# EAGLE schematic telakone (EAGLE 7.6.0)

## Sheet 1 of 8: POWER
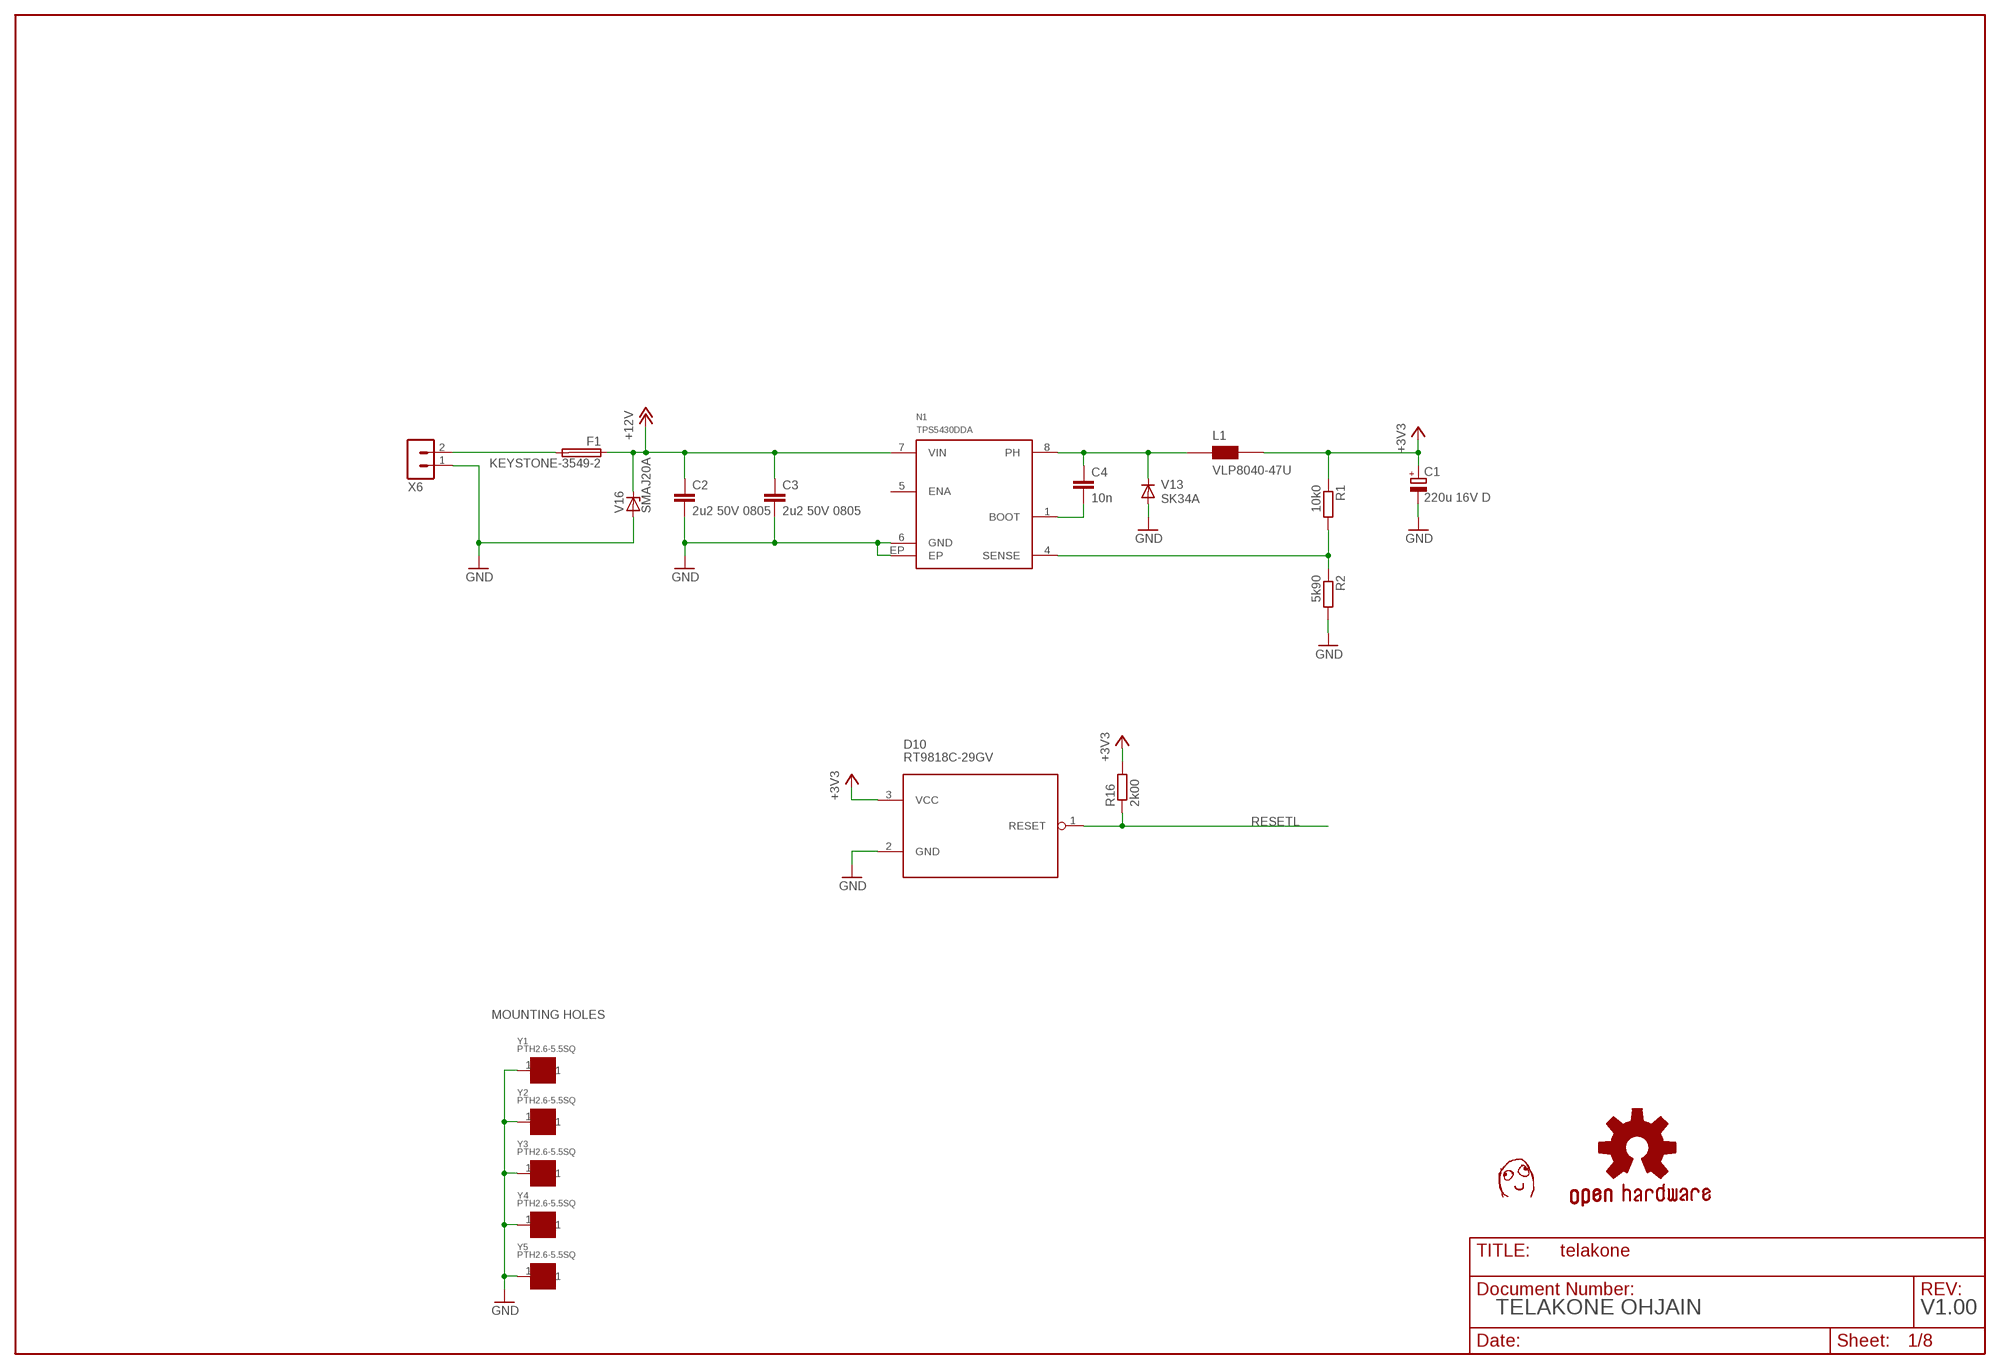
[diagram p0: schematic, sheet 1]

### Parts
C1  220u 16V D  CPOL-EUCT7343  [CT7343]
C2  2u2 50V 0805  CAP0805  [C0805]
C3  2u2 50V 0805  CAP0805  [C0805]
C4  10n  CAP0603  [C0603]
D10  RT9818C-29GV  [SOT23]
F1  KEYSTONE-3549-2  [KEYSTONE-3549-2]
L1  VLP8040-47U  [VLP8040]
N1  TPS5430DDA  [SOIC8-N-EP]
R1  10k0  RES0603  [R0603]
R2  5k90  RES0603  [R0603]
R16  2k00  RES0603  [R0603]
U$1  DAFUG  [DAFUG]
V13  SK34A  [DO214AC]
V16  SMAJ20A  SMAJXXA  [DO214AC]
X6  TE_RUUVILIITIN2  [TE_RUUVILIITIN2]
Y1  PTH2.6-5.5SQ  [PTH-2.6-5.5SQ]
Y2  PTH2.6-5.5SQ  [PTH-2.6-5.5SQ]
Y3  PTH2.6-5.5SQ  [PTH-2.6-5.5SQ]
Y4  PTH2.6-5.5SQ  [PTH-2.6-5.5SQ]
Y5  PTH2.6-5.5SQ  [PTH-2.6-5.5SQ]

### Nets
+3V3: C1.+ D10.3(VCC) L1.2(B) R1.1 R16.2 ; also sheet 2,3,4,5,6,7,8
+12V: C2.1 C3.1 F1.1 F1.4 N1.7(VIN) V16.C ; also sheet 2,3,6
GND [other]: C1.- C2.2 C3.2 D10.2(GND) N1.6(GND) N1.EP R2.2 V13.A V16.A X6.1 Y1.1 Y2.1 Y3.1 Y4.1 Y5.1 ; also sheet 2,3,4,5,6,7,8
N$1: C4.1 L1.1(A) N1.8(PH) V13.C
N$2: C4.2 N1.1(BOOT)
N$4: N1.4(SENSE) R1.2 R2.1
N$8: F1.2 F1.3 X6.2
RESETL: D10.1(RESET) R16.1 ; also sheet 6,8
Unconnected: N1.5(ENA)

### Notes on the sheet
- MOUNTING HOLES
- TELAKONE OHJAIN | V1.00

## Sheet 2 of 8: OUTPUTS
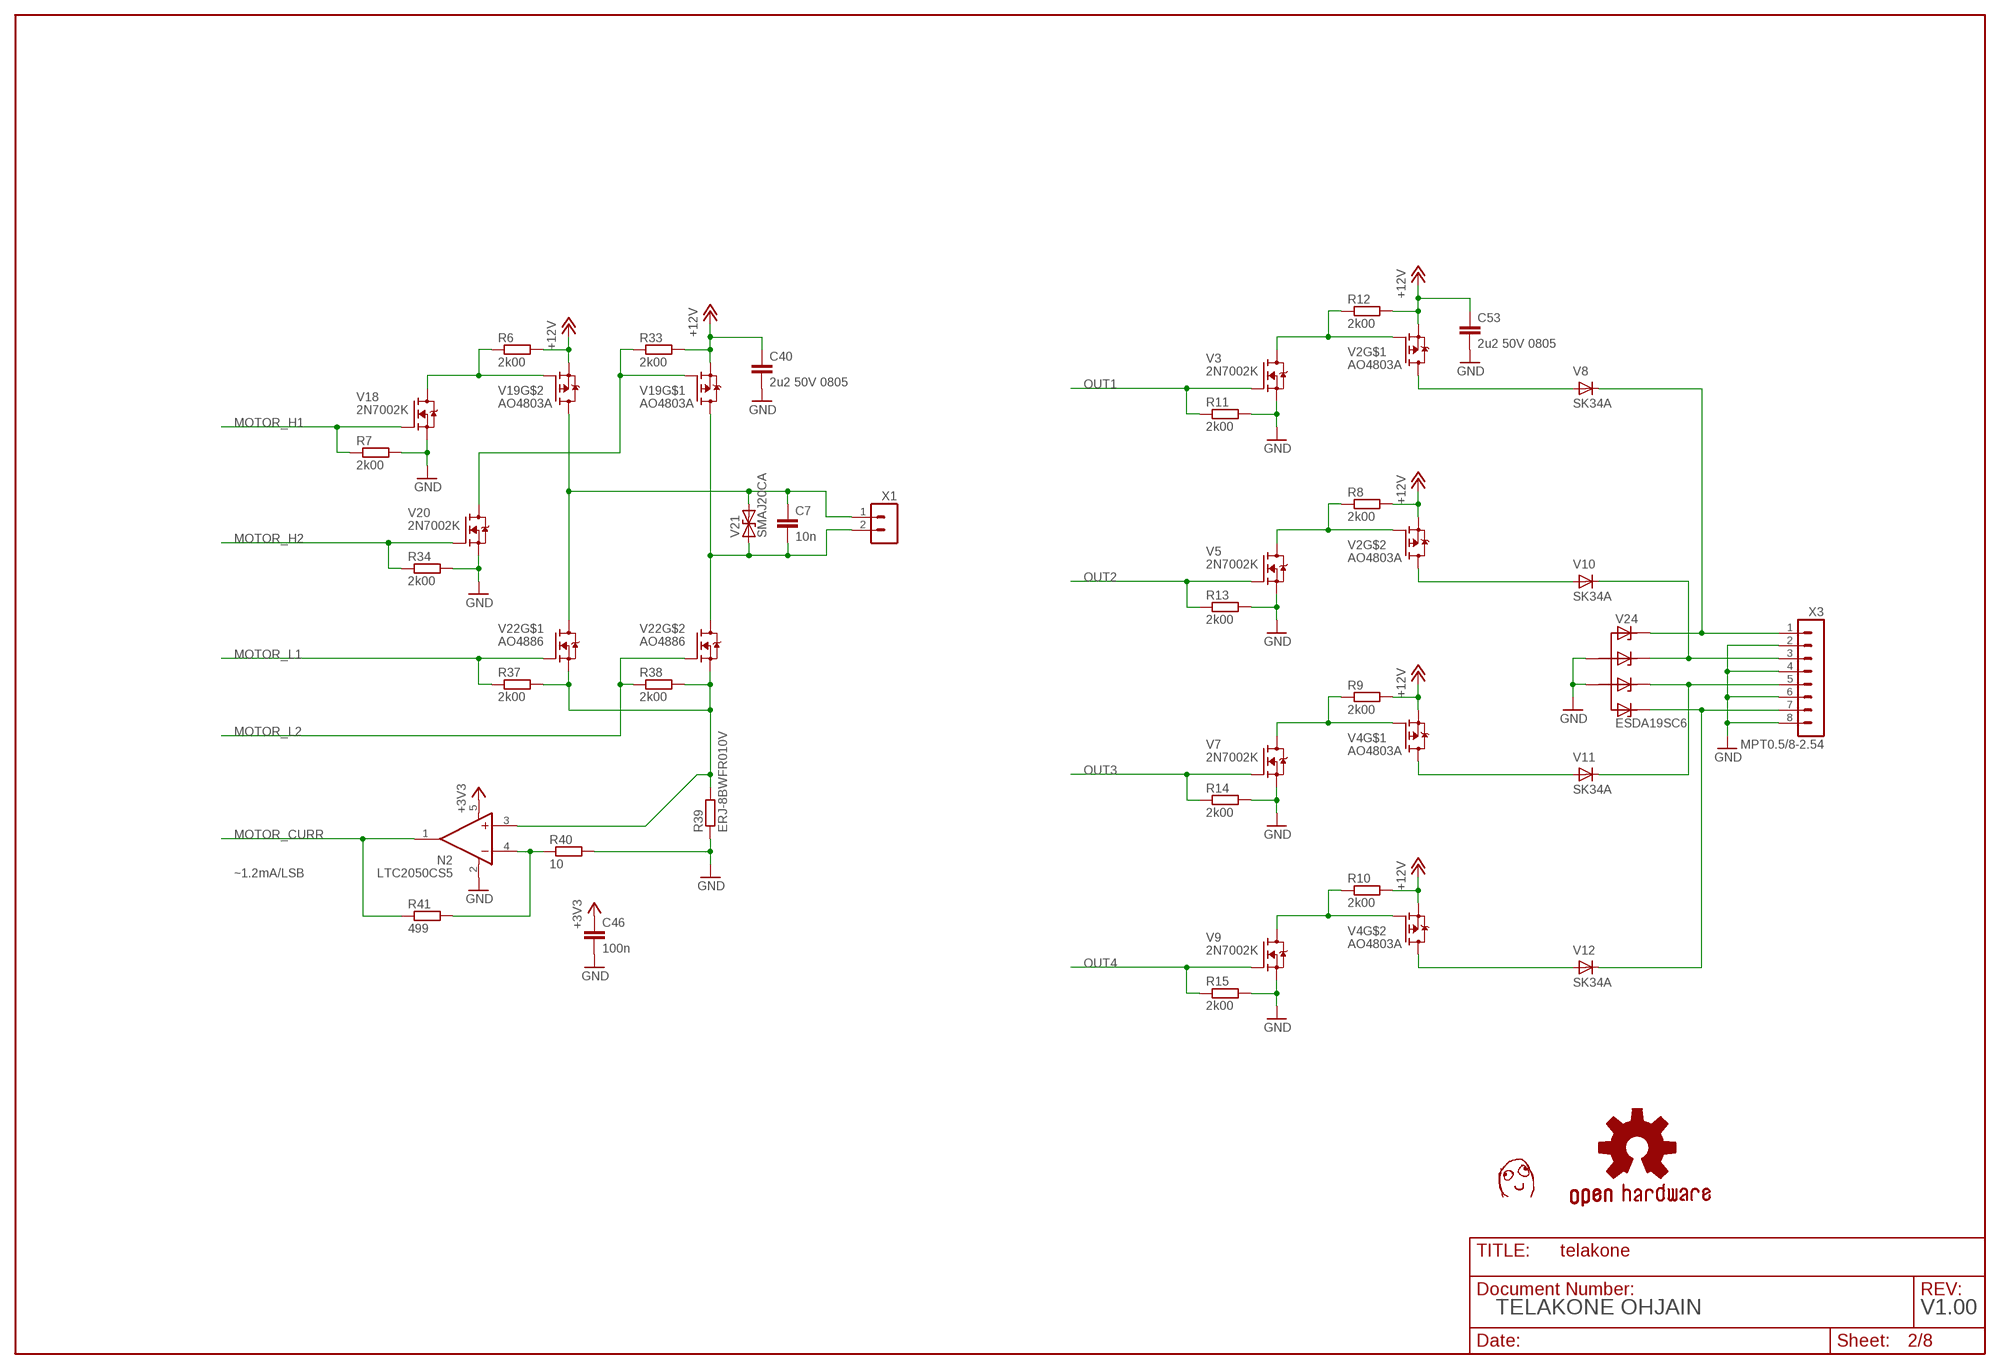
[diagram p1: schematic, sheet 2]

### Parts
C7  10n  CAP0603  [C0603]
C40  2u2 50V 0805  CAP0805  [C0805]
C46  100n  CAP0603  [C0603]
C53  2u2 50V 0805  CAP0805  [C0805]
N2  LTC2050CS5  [SOT95P280X145-5N]
R6  2k00  RES0603  [R0603]
R7  2k00  RES0603  [R0603]
R8  2k00  RES0603  [R0603]
R9  2k00  RES0603  [R0603]
R10  2k00  RES0603  [R0603]
R11  2k00  RES0603  [R0603]
R12  2k00  RES0603  [R0603]
R13  2k00  RES0603  [R0603]
R14  2k00  RES0603  [R0603]
R15  2k00  RES0603  [R0603]
R33  2k00  RES0603  [R0603]
R34  2k00  RES0603  [R0603]
R37  2k00  RES0603  [R0603]
R38  2k00  RES0603  [R0603]
R39  ERJ-8BWFR010V  RES1206  [R1206]
R40  10  RES0603  [R0603]
R41  499  RES0603  [R0603]
U$3  DAFUG  [DAFUG]
V2  AO4803A  [SOIC8-N_MC]
V3  2N7002K  [SOT23]
V4  AO4803A  [SOIC8-N_MC]
V5  2N7002K  [SOT23]
V7  2N7002K  [SOT23]
V8  SK34A  [DO214AC]
V9  2N7002K  [SOT23]
V10  SK34A  [DO214AC]
V11  SK34A  [DO214AC]
V12  SK34A  [DO214AC]
V18  2N7002K  [SOT23]
V19  AO4803A  [SOIC8-N_MC]
V20  2N7002K  [SOT23]
V21  SMAJ20CA  SMAJXXCA  [DO214AC]
V22  AO4886  [SOIC8-N_MC]
V24  ESDA19SC6  ESDAXXSC6  [SOT23-6]
X1  TE_RUUVILIITIN2  [TE_RUUVILIITIN2]
X3  MPT0.5/8-2.54  [MPT0.5/8-2.54]

### Nets
+3V3: C46.1 N2.5(V+) ; also sheet 1,3,4,5,6,7,8
+12V: C40.1 C53.1 R6.2 R8.2 R9.2 R10.2 R12.2 R33.2 V2.1(S) V2.3(S) V4.1(S) V4.3(S) V19.1(S) V19.3(S) ; also sheet 1,3,6
GND [other]: C40.2 C46.2 C53.2 N2.2(V-) R7.2 R11.2 R13.2 R14.2 R15.2 R34.2 R39.1 R40.2 V3.2(S) V5.2(S) V7.2(S) V9.2(S) V18.2(S) V20.2(S) V24.2(A) V24.5(A1) X3.2 X3.4 X3.6 X3.8 ; also sheet 1,3,4,5,6,7,8
MOTOR_CURR: N2.1(OUT) R41.1 ; also sheet 7
MOTOR_H1: R7.1 V18.1(G) ; also sheet 7
MOTOR_H2: R34.1 V20.1(G) ; also sheet 7
MOTOR_L1: R37.1 V22.4(G) ; also sheet 7
MOTOR_L2: R38.1 V22.2(G) ; also sheet 7
N$3: R6.1 V18.3(D) V19.2(G)
N$6: R33.1 V19.4(G) V20.3(D)
N$7: N2.3(+IN) R37.2 R38.2 R39.2 V22.1(S) V22.3(S)
N$9: N2.4(-IN) R40.1 R41.2
N$10: R8.1 V2.2(G) V5.3(D)
N$11: R12.1 V2.4(G) V3.3(D)
N$13: R9.1 V4.4(G) V7.3(D)
N$15: R10.1 V4.2(G) V9.3(D)
N$17: V12.C V24.6(C3) X3.7
N$19: V11.C V24.4(C2) X3.5
N$20: V10.C V24.3(C1) X3.3
N$21: V8.C V24.1(C) X3.1
NERT: V2.5(D) V2.6(D) V8.A
NERT1: V2.7(D) V2.8(D) V10.A
NERT2: V4.5(D) V4.6(D) V11.A
NERT3: V4.7(D) V4.8(D) V12.A
NERT4: C7.1 V19.7(D) V19.8(D) V21.A V22.5(D) V22.6(D) X1.1
NERT5: C7.2 V19.5(D) V19.6(D) V21.C V22.7(D) V22.8(D) X1.2
OUT1: R11.1 V3.1(G) ; also sheet 7
OUT2: R13.1 V5.1(G) ; also sheet 7
OUT3: R14.1 V7.1(G) ; also sheet 7
OUT4: R15.1 V9.1(G) ; also sheet 7

### Notes on the sheet
- ~1.2mA/LSB
- TELAKONE OHJAIN | V1.00

## Sheet 3 of 8: INPUTS
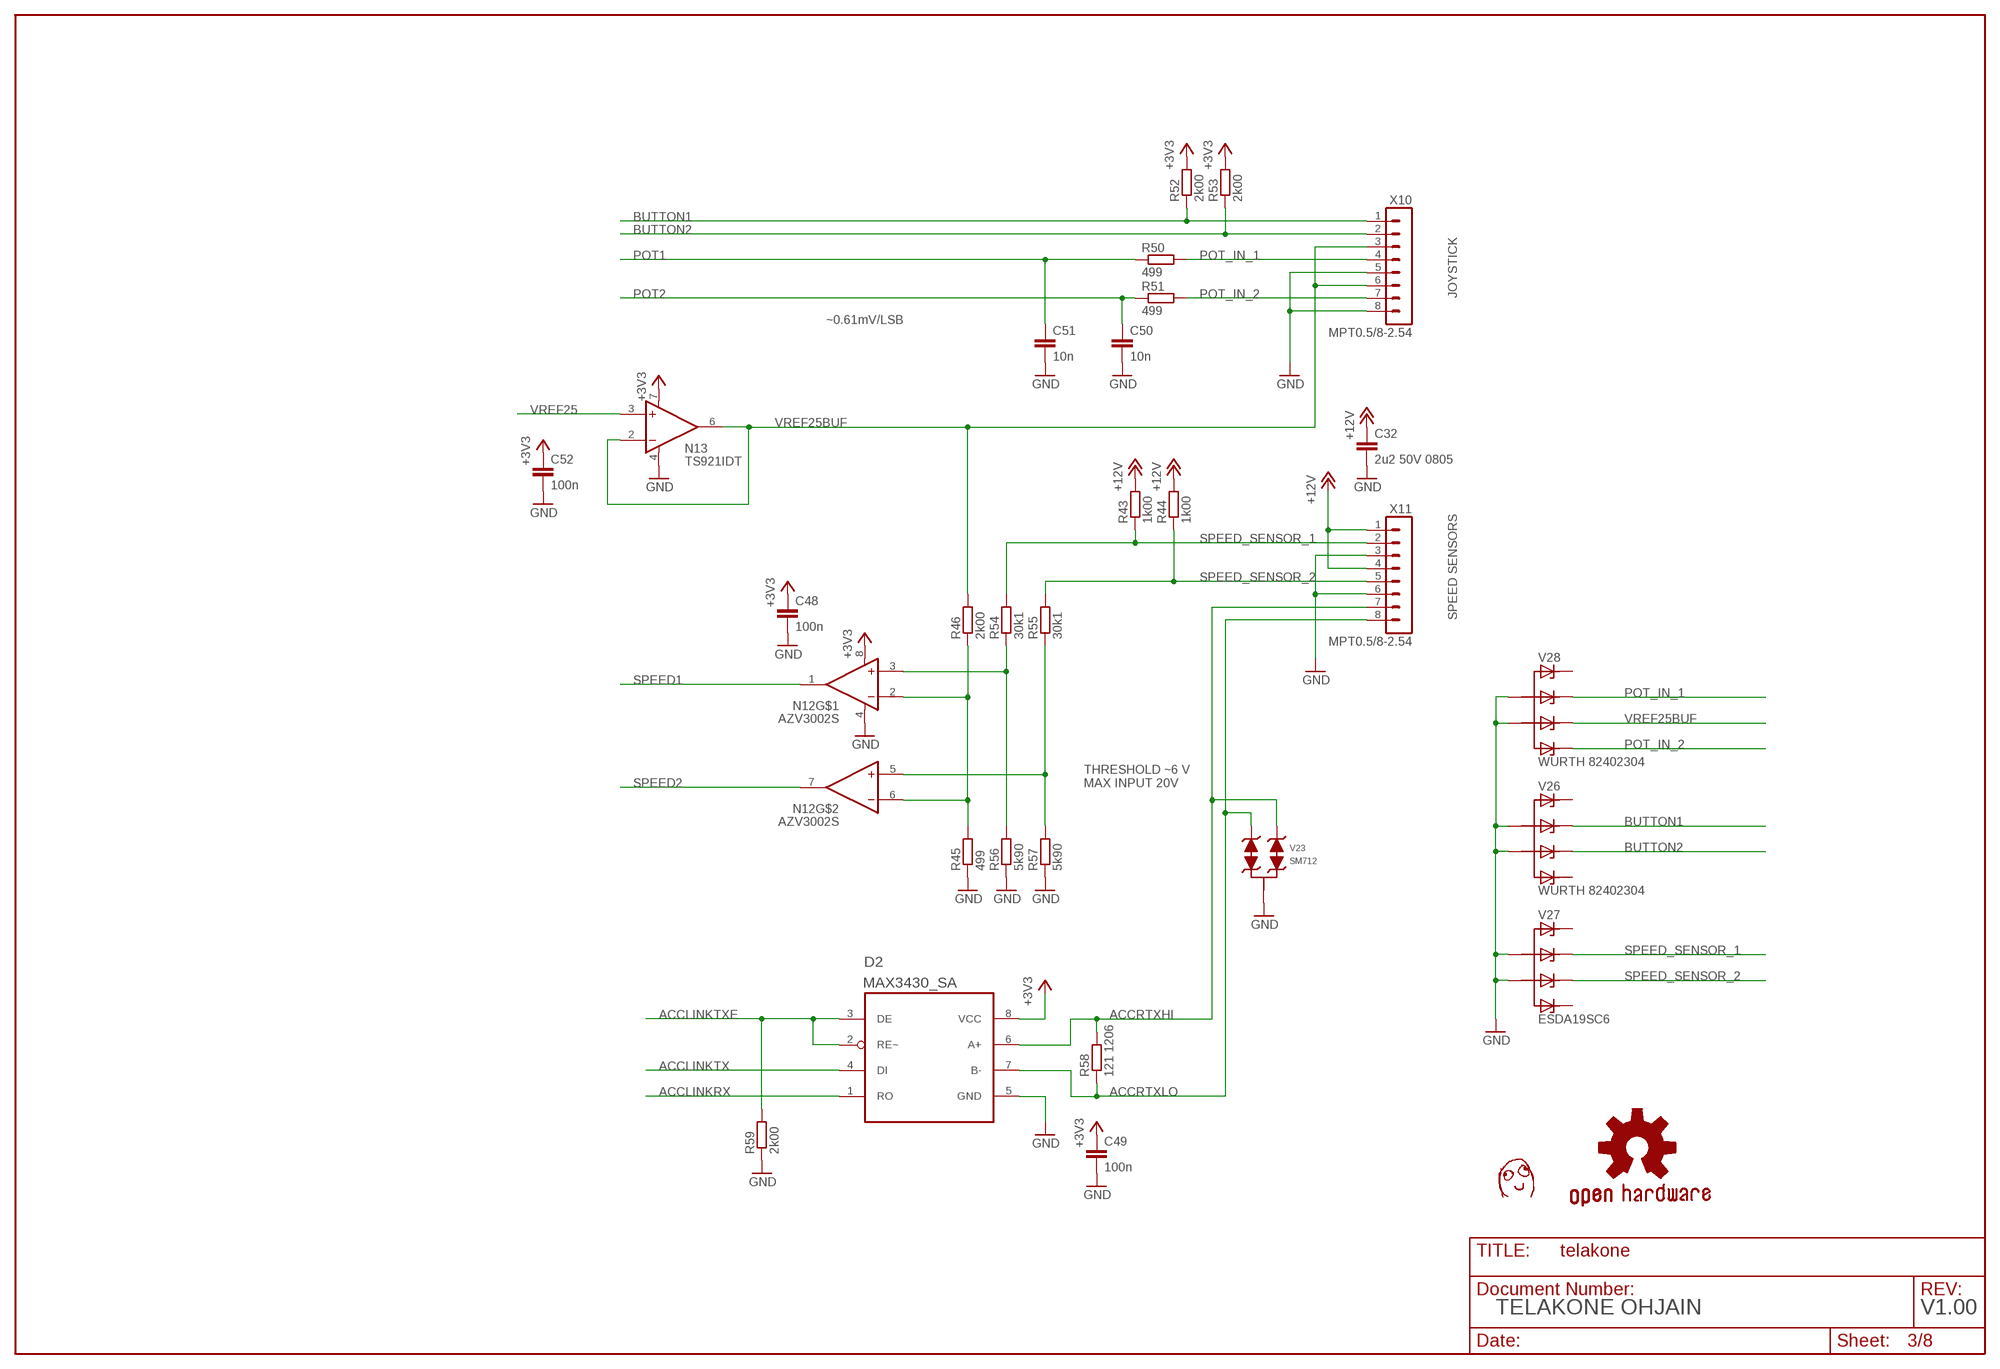
[diagram p2: schematic, sheet 3]

### Parts
C32  2u2 50V 0805  CAP0805  [C0805]
C48  100n  CAP0603  [C0603]
C49  100n  CAP0603  [C0603]
C50  10n  CAP0603  [C0603]
C51  10n  CAP0603  [C0603]
C52  100n  CAP0603  [C0603]
D2  MAX3430_SA  MAX3088_SA  [SOIC8-N_MC]
N12  AZV3002S  [SOIC8-N_MC]
N13  TS921IDT  [SOIC8-N_MC]
R43  1k00  RES0603  [R0603]
R44  1k00  RES0603  [R0603]
R45  499  RES0603  [R0603]
R46  2k00  RES0603  [R0603]
R50  499  RES0603  [R0603]
R51  499  RES0603  [R0603]
R52  2k00  RES0603  [R0603]
R53  2k00  RES0603  [R0603]
R54  30k1  RES0603  [R0603]
R55  30k1  RES0603  [R0603]
R56  5k90  RES0603  [R0603]
R57  5k90  RES0603  [R0603]
R58  121 1206  RES1206  [R1206]
R59  2k00  RES0603  [R0603]
U$5  DAFUG  [DAFUG]
V23  SM712  [SOT23]
V26  WURTH 82402304  ESDAXXSC6  [SOT23-6]
V27  ESDA19SC6  ESDAXXSC6  [SOT23-6]
V28  WURTH 82402304  ESDAXXSC6  [SOT23-6]
X10  MPT0.5/8-2.54  [MPT0.5/8-2.54]
X11  MPT0.5/8-2.54  [MPT0.5/8-2.54]

### Nets
+3V3: C48.1 C49.1 C52.1 D2.8(VCC) N12.8(V+) N13.7(V+) R52.2 R53.2 ; also sheet 1,2,4,5,6,7,8
+12V: C32.1 R43.2 R44.2 X11.1 X11.4 ; also sheet 1,2,6
ACCLINKRX: D2.1(RO) ; also sheet 7
ACCLINKTX: D2.4(DI) ; also sheet 7
ACCLINKTXE: D2.2(RE~) D2.3(DE) R59.2 ; also sheet 7
ACCRTXHI: D2.6(A+) R58.2 V23.1 X11.7
ACCRTXLO: D2.7(B-) R58.1 V23.2 X11.8
BUTTON1: R52.1 V26.3(C1) X10.1 ; also sheet 7
BUTTON2: R53.1 V26.4(C2) X10.2 ; also sheet 7
GND [other]: C32.2 C48.2 C49.2 C50.2 C51.2 C52.2 D2.5(GND) N12.4(V-) N13.4(V-) R45.1 R56.1 R57.1 R59.1 V23.3 V26.2(A) V26.5(A1) V27.2(A) V27.5(A1) V28.2(A) V28.5(A1) X10.5 X10.8 X11.3 X11.6 ; also sheet 1,2,4,5,6,7,8
N$5: N12.3(+IN) R54.1 R56.2
N$12: N12.5(+IN) R55.1 R57.2
N$14: N12.2(-IN) N12.6(-IN) R45.2 R46.1
POT1: C51.1 R50.1 ; also sheet 7
POT2: C50.1 R51.1 ; also sheet 7
POT_IN_1: R50.2 V28.3(C1) X10.4
POT_IN_2: R51.2 V28.6(C3) X10.7
SPEED1: N12.1(OUT) ; also sheet 7
SPEED2: N12.7(OUT) ; also sheet 7
SPEED_SENSOR_1: R43.1 R54.2 V27.3(C1) X11.2
SPEED_SENSOR_2: R44.1 R55.2 V27.4(C2) X11.5
VREF25: N13.3(+IN) ; also sheet 6
VREF25BUF: N13.2(-IN) N13.6(OUT) R46.2 V28.4(C2) X10.3 X10.6
Unconnected: V26.1(C) V26.6(C3) V27.1(C) V27.6(C3) V28.1(C)

### Notes on the sheet
- JOYSTICK
- ~0.61mV/LSB
- SPEED SENSORS
- THRESHOLD ~6 V
  MAX INPUT 20V
- TELAKONE OHJAIN | V1.00

## Sheet 4 of 8: DRIVE1
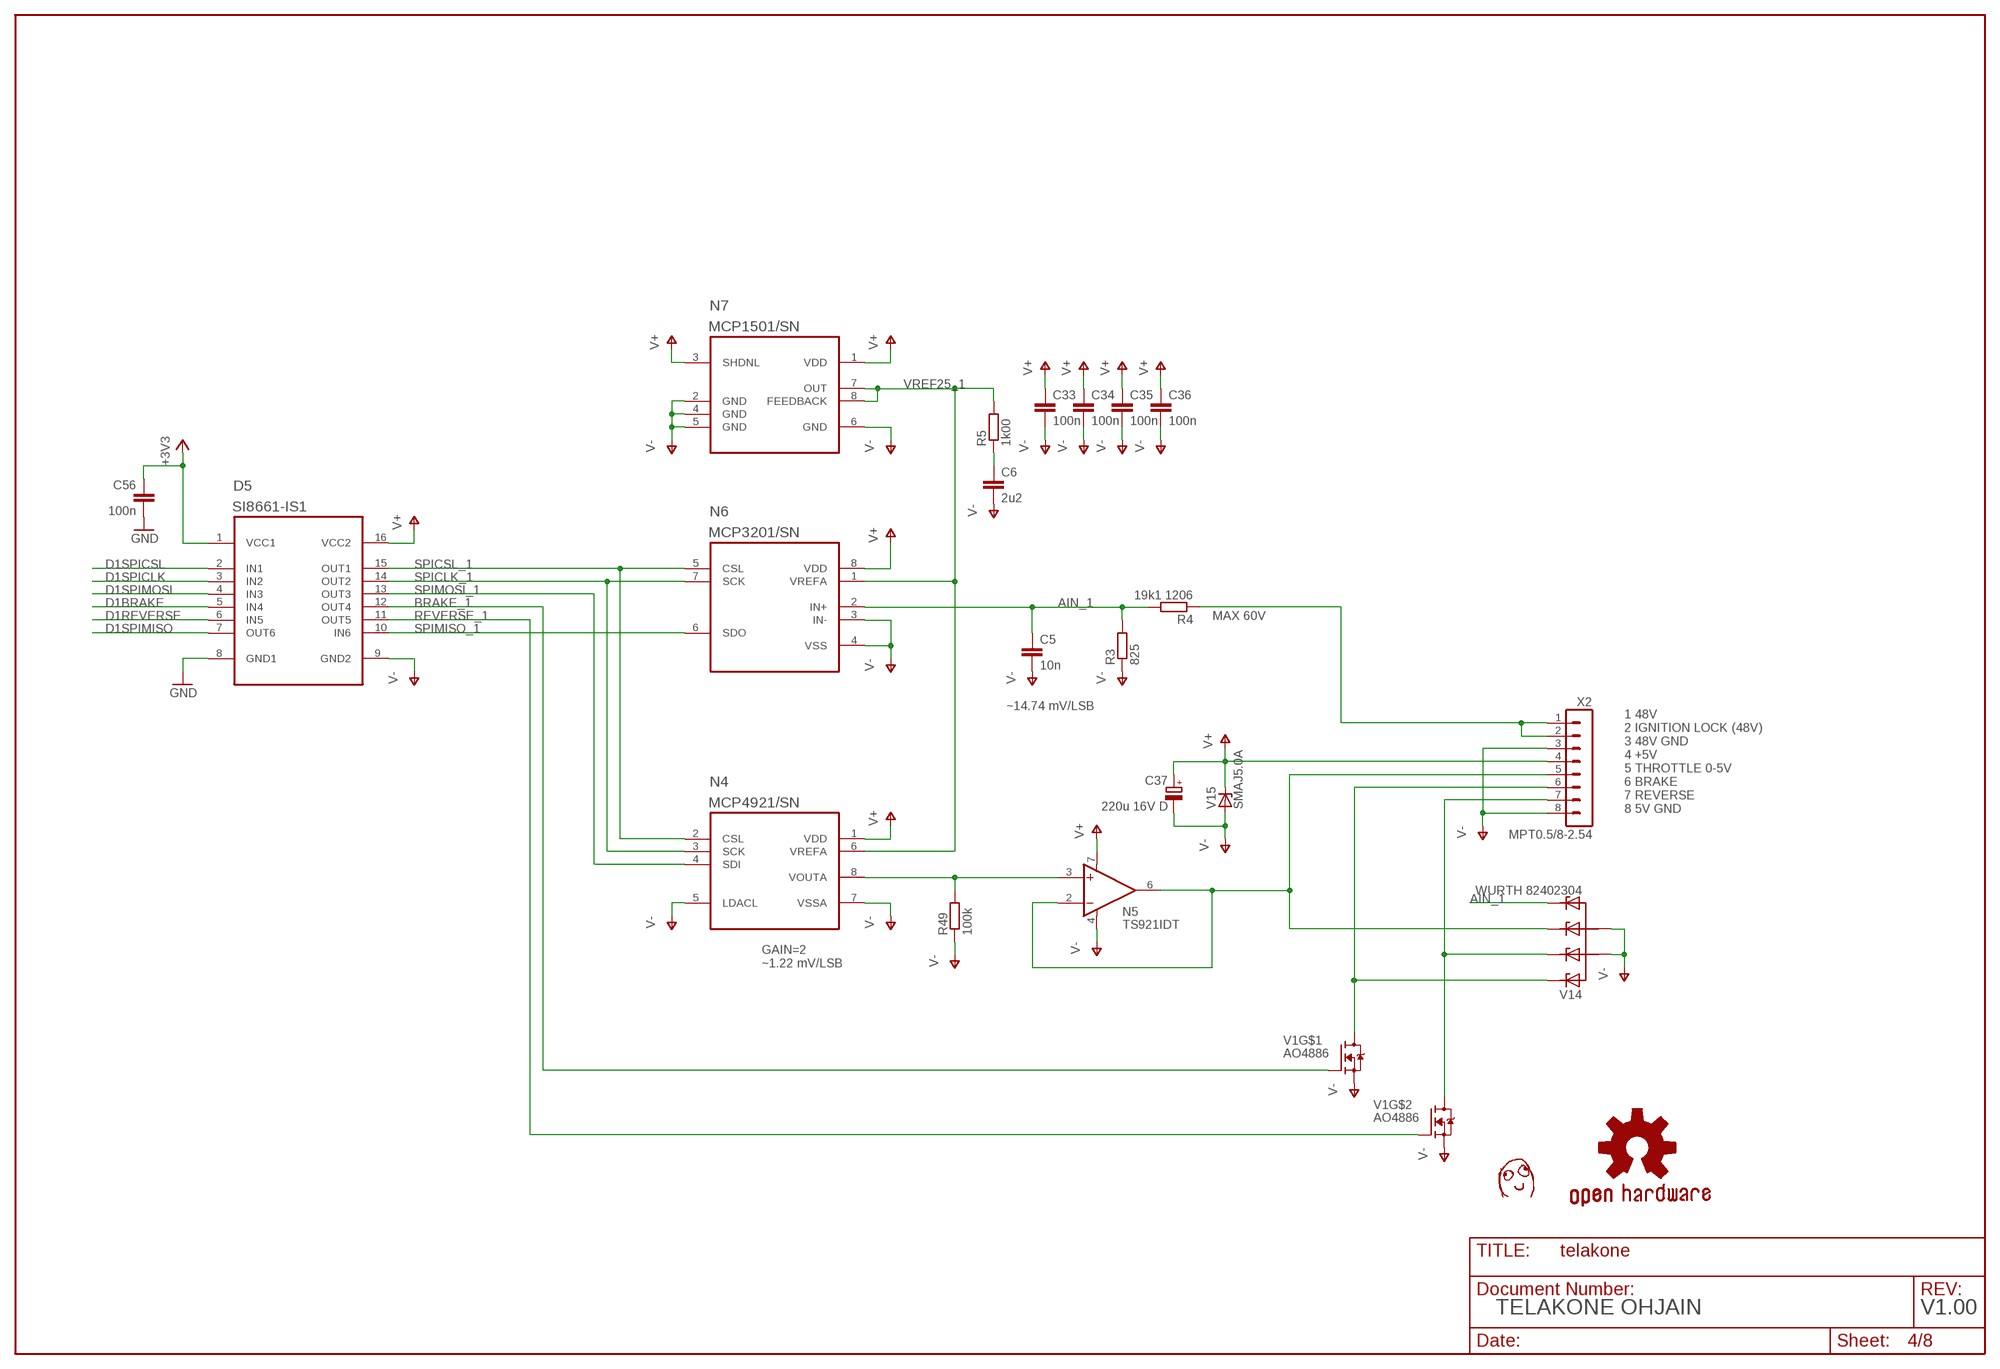
[diagram p3: schematic, sheet 4]

### Parts
C5  10n  CAP0603  [C0603]
C6  2u2  CAP0603  [C0603]
C33  100n  CAP0603  [C0603]
C34  100n  CAP0603  [C0603]
C35  100n  CAP0603  [C0603]
C36  100n  CAP0603  [C0603]
C37  220u 16V D  CPOL-EUCT7343  [CT7343]
C56  100n  CAP0603  [C0603]
D5  SI8661-IS1  [SOIC16-N]
N4  MCP4921/SN  [SOIC8-N_MC]
N5  TS921IDT  [SOIC8-N_MC]
N6  MCP3201/SN  [SOIC8-N_MC]
N7  MCP1501/SN  [SOIC8-N_MC]
R3  825  RES0603  [R0603]
R4  19k1 1206  RES1206  [R1206]
R5  1k00  RES0603  [R0603]
R49  100k  RES0603  [R0603]
U$7  DAFUG  [DAFUG]
V1  AO4886  [SOIC8-N_MC]
V14  WURTH 82402304  ESDAXXSC6  [SOT23-6]
V15  SMAJ5.0A  SMAJXXA  [DO214AC]
X2  MPT0.5/8-2.54  [MPT0.5/8-2.54]

### Nets
+3V3: C56.1 D5.1(VCC1) ; also sheet 1,2,3,5,6,7,8
+48V_1 [isolation]: R4.1 X2.1 X2.2
AIN_1 [isolation]: C5.1 N6.2(IN+) R3.2 R4.2 V14.6(C3)
BRAKE_1 [isolation]: D5.12(OUT4) V1.4(G)
BRAKE_OD_1 [isolation]: V1.5(D) V1.6(D) V14.1(C) X2.6
D1BRAKE: D5.5(IN4) ; also sheet 7
D1REVERSE: D5.6(IN5) ; also sheet 7
D1SPICLK: D5.3(IN2) ; also sheet 7
D1SPICSL: D5.2(IN1) ; also sheet 7
D1SPIMISO: D5.7(OUT6) ; also sheet 7
D1SPIMOSI: D5.4(IN3) ; also sheet 7
GND [other]: C56.2 D5.8(GND1) ; also sheet 1,2,3,5,6,7,8
N$18 [isolation]: C6.1 R5.1
REVERSE_1 [isolation]: D5.11(OUT5) V1.2(G)
REVERSE_OD_1 [isolation]: V1.7(D) V1.8(D) V14.3(C1) X2.7
SPICLK_1 [isolation]: D5.14(OUT2) N4.3(SCK) N6.7(SCK)
SPICSL_1 [isolation]: D5.15(OUT1) N4.2(CSL) N6.5(CSL)
SPIMISO_1 [isolation]: D5.10(IN6) N6.6(SDO)
SPIMOSI_1 [isolation]: D5.13(OUT3) N4.4(SDI)
THROTTLE_1 [isolation]: N4.8(VOUTA) N5.3(+IN) R49.2
THROTTLE_BUFFERED_1 [isolation]: N5.2(-IN) N5.6(OUT) V14.4(C2) X2.5
V+1 [isolation]: C33.1 C34.1 C35.1 C36.1 C37.+ D5.16(VCC2) N4.1(VDD) N5.7(V+) N6.8(VDD) N7.1(VDD) N7.3(SHDNL) V15.C X2.4 ; supply symbol labelled V+
V-1 [isolation]: C5.2 C6.2 C33.2 C34.2 C35.2 C36.2 C37.- D5.9(GND2) N4.5(LDACL) N4.7(VSSA) N5.4(V-) N6.3(IN-) N6.4(VSS) N7.2(GND) N7.4(GND) N7.5(GND) N7.6(GND) R3.1 R49.1 V1.1(S) V1.3(S) V14.2(A) V14.5(A1) V15.A X2.3 X2.8 ; supply symbol labelled V-
VREF25_1 [isolation]: N4.6(VREFA) N6.1(VREFA) N7.7(OUT) N7.8(FEEDBACK) R5.2

### Notes on the sheet
- MAX 60V
- ~14.74 mV/LSB
- 1 48V
  2 IGNITION LOCK (48V)
  3 48V GND
  4 +5V
  5 THROTTLE 0-5V
  6 BRAKE
  7 REVERSE
  8 5V GND
- GAIN=2
  ~1.22 mV/LSB
- TELAKONE OHJAIN | V1.00

## Sheet 5 of 8: DRIVE2
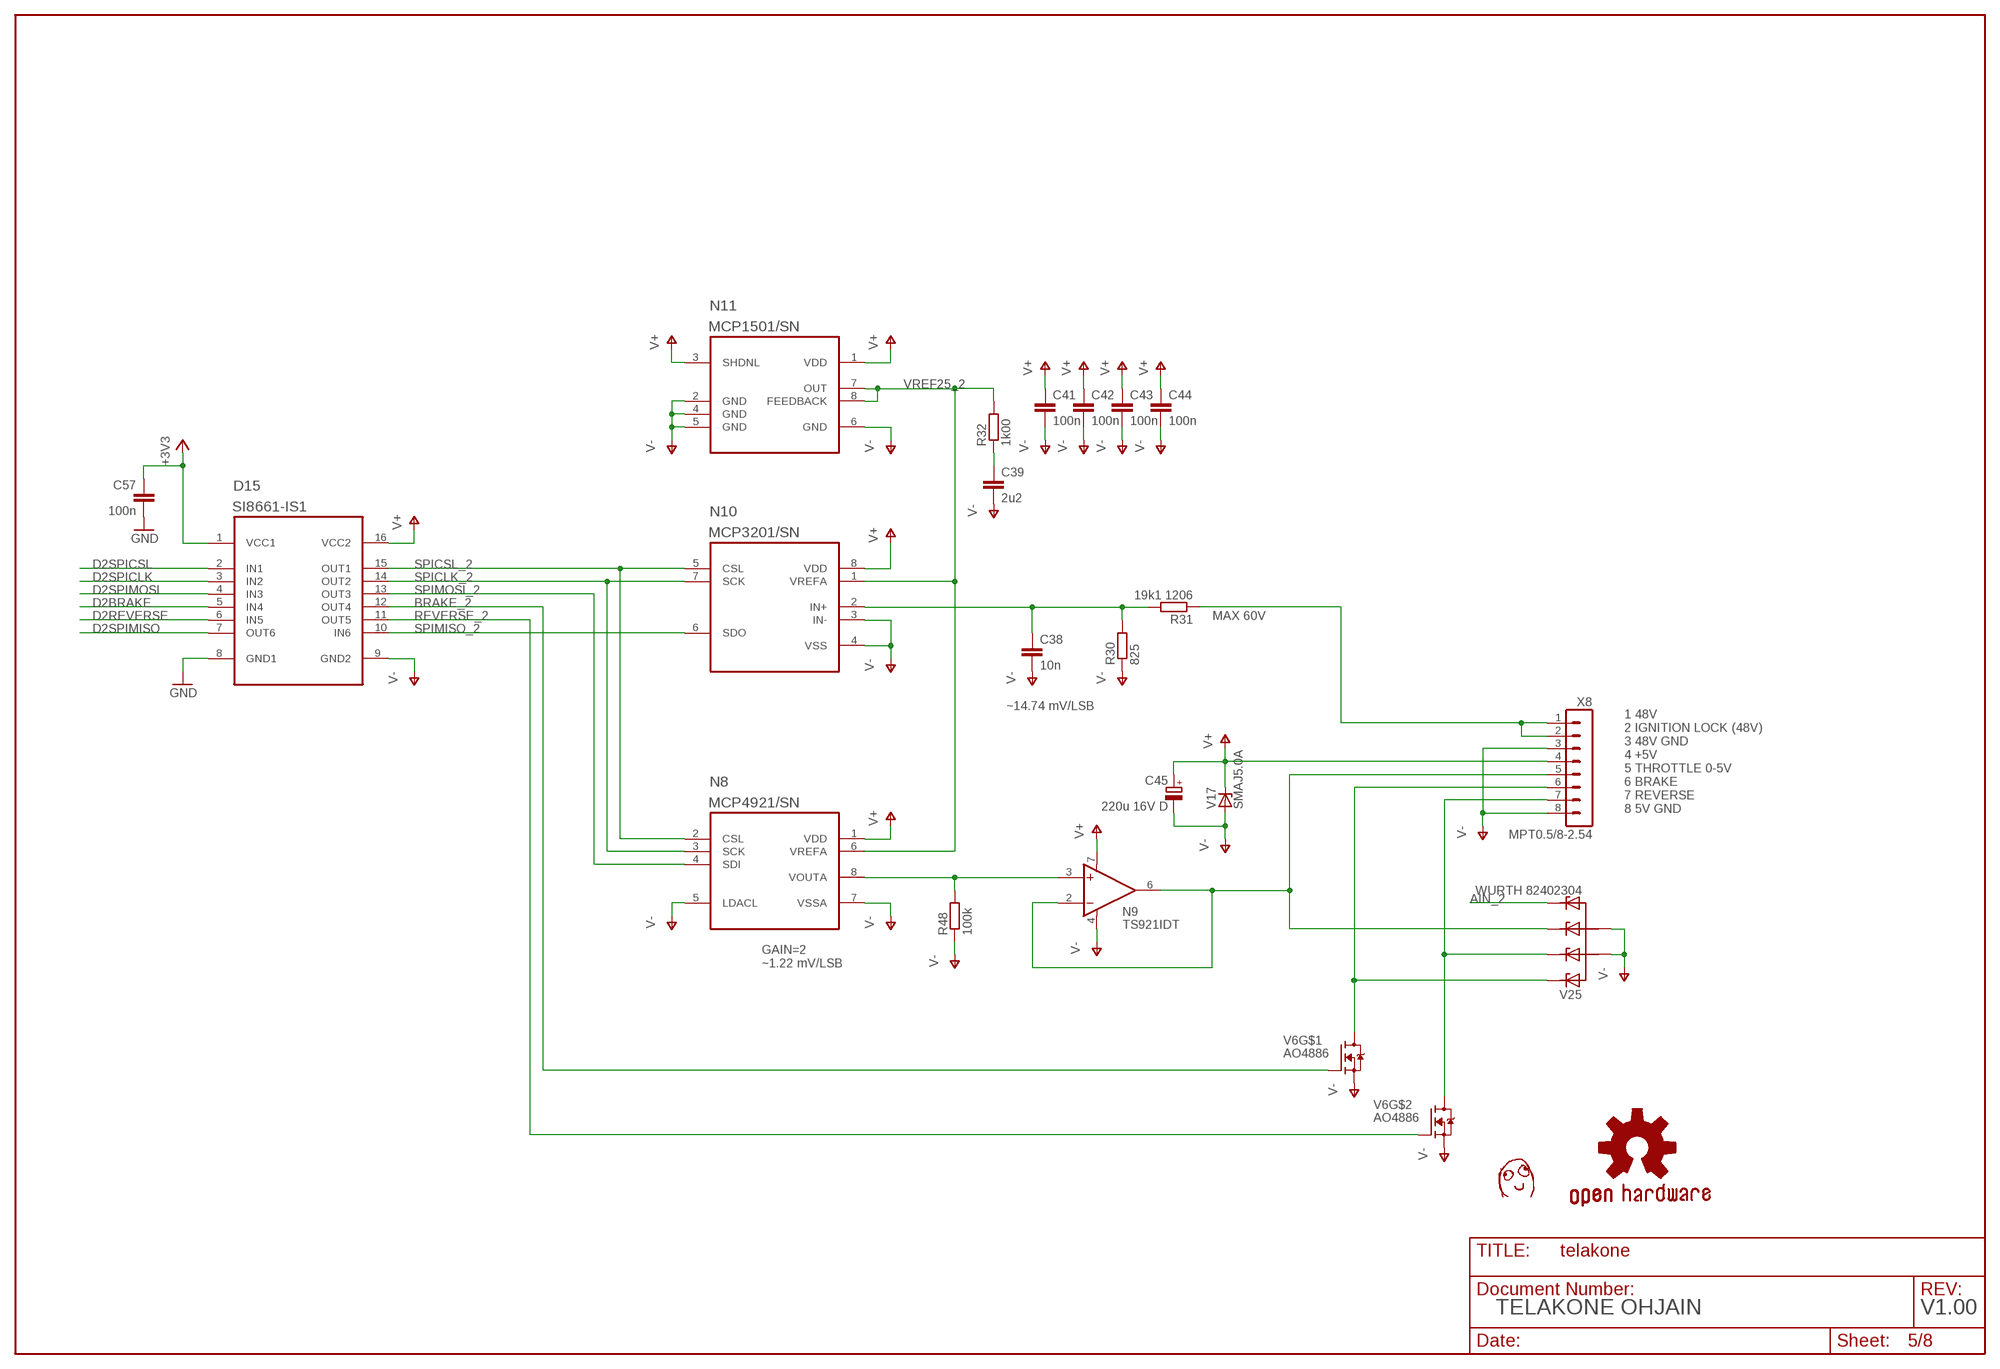
[diagram p4: schematic, sheet 5]

### Parts
C38  10n  CAP0603  [C0603]
C39  2u2  CAP0603  [C0603]
C41  100n  CAP0603  [C0603]
C42  100n  CAP0603  [C0603]
C43  100n  CAP0603  [C0603]
C44  100n  CAP0603  [C0603]
C45  220u 16V D  CPOL-EUCT7343  [CT7343]
C57  100n  CAP0603  [C0603]
D15  SI8661-IS1  [SOIC16-N]
N8  MCP4921/SN  [SOIC8-N_MC]
N9  TS921IDT  [SOIC8-N_MC]
N10  MCP3201/SN  [SOIC8-N_MC]
N11  MCP1501/SN  [SOIC8-N_MC]
R30  825  RES0603  [R0603]
R31  19k1 1206  RES1206  [R1206]
R32  1k00  RES0603  [R0603]
R48  100k  RES0603  [R0603]
U$9  DAFUG  [DAFUG]
V6  AO4886  [SOIC8-N_MC]
V17  SMAJ5.0A  SMAJXXA  [DO214AC]
V25  WURTH 82402304  ESDAXXSC6  [SOT23-6]
X8  MPT0.5/8-2.54  [MPT0.5/8-2.54]

### Nets
+3V3: C57.1 D15.1(VCC1) ; also sheet 1,2,3,4,6,7,8
+48V_2 [isolation]: R31.1 X8.1 X8.2
AIN_2 [isolation]: C38.1 N10.2(IN+) R30.2 R31.2 V25.6(C3)
BRAKE_2 [isolation]: D15.12(OUT4) V6.4(G)
BRAKE_OD_2 [isolation]: V6.5(D) V6.6(D) V25.1(C) X8.6
D2BRAKE: D15.5(IN4) ; also sheet 7
D2REVERSE: D15.6(IN5) ; also sheet 7
D2SPICLK: D15.3(IN2) ; also sheet 7
D2SPICSL: D15.2(IN1) ; also sheet 7
D2SPIMISO: D15.7(OUT6) ; also sheet 7
D2SPIMOSI: D15.4(IN3) ; also sheet 7
GND [other]: C57.2 D15.8(GND1) ; also sheet 1,2,3,4,6,7,8
N$42 [isolation]: C39.1 R32.1
REVERSE_2 [isolation]: D15.11(OUT5) V6.2(G)
REVERSE_OD_2 [isolation]: V6.7(D) V6.8(D) V25.3(C1) X8.7
SPICLK_2 [isolation]: D15.14(OUT2) N8.3(SCK) N10.7(SCK)
SPICSL_2 [isolation]: D15.15(OUT1) N8.2(CSL) N10.5(CSL)
SPIMISO_2 [isolation]: D15.10(IN6) N10.6(SDO)
SPIMOSI_2 [isolation]: D15.13(OUT3) N8.4(SDI)
THROTTLE_2 [isolation]: N8.8(VOUTA) N9.3(+IN) R48.2
THROTTLE_BUFFERED_2 [isolation]: N9.2(-IN) N9.6(OUT) V25.4(C2) X8.5
V+2 [isolation]: C41.1 C42.1 C43.1 C44.1 C45.+ D15.16(VCC2) N8.1(VDD) N9.7(V+) N10.8(VDD) N11.1(VDD) N11.3(SHDNL) V17.C X8.4 ; supply symbol labelled V+
V-2 [isolation]: C38.2 C39.2 C41.2 C42.2 C43.2 C44.2 C45.- D15.9(GND2) N8.5(LDACL) N8.7(VSSA) N9.4(V-) N10.3(IN-) N10.4(VSS) N11.2(GND) N11.4(GND) N11.5(GND) N11.6(GND) R30.1 R48.1 V6.1(S) V6.3(S) V17.A V25.2(A) V25.5(A1) X8.3 X8.8 ; supply symbol labelled V-
VREF25_2 [isolation]: N8.6(VREFA) N10.1(VREFA) N11.7(OUT) N11.8(FEEDBACK) R32.2

### Notes on the sheet
- MAX 60V
- ~14.74 mV/LSB
- 1 48V
  2 IGNITION LOCK (48V)
  3 48V GND
  4 +5V
  5 THROTTLE 0-5V
  6 BRAKE
  7 REVERSE
  8 5V GND
- GAIN=2
  ~1.22 mV/LSB
- TELAKONE OHJAIN | V1.00

## Sheet 6 of 8: CPU1
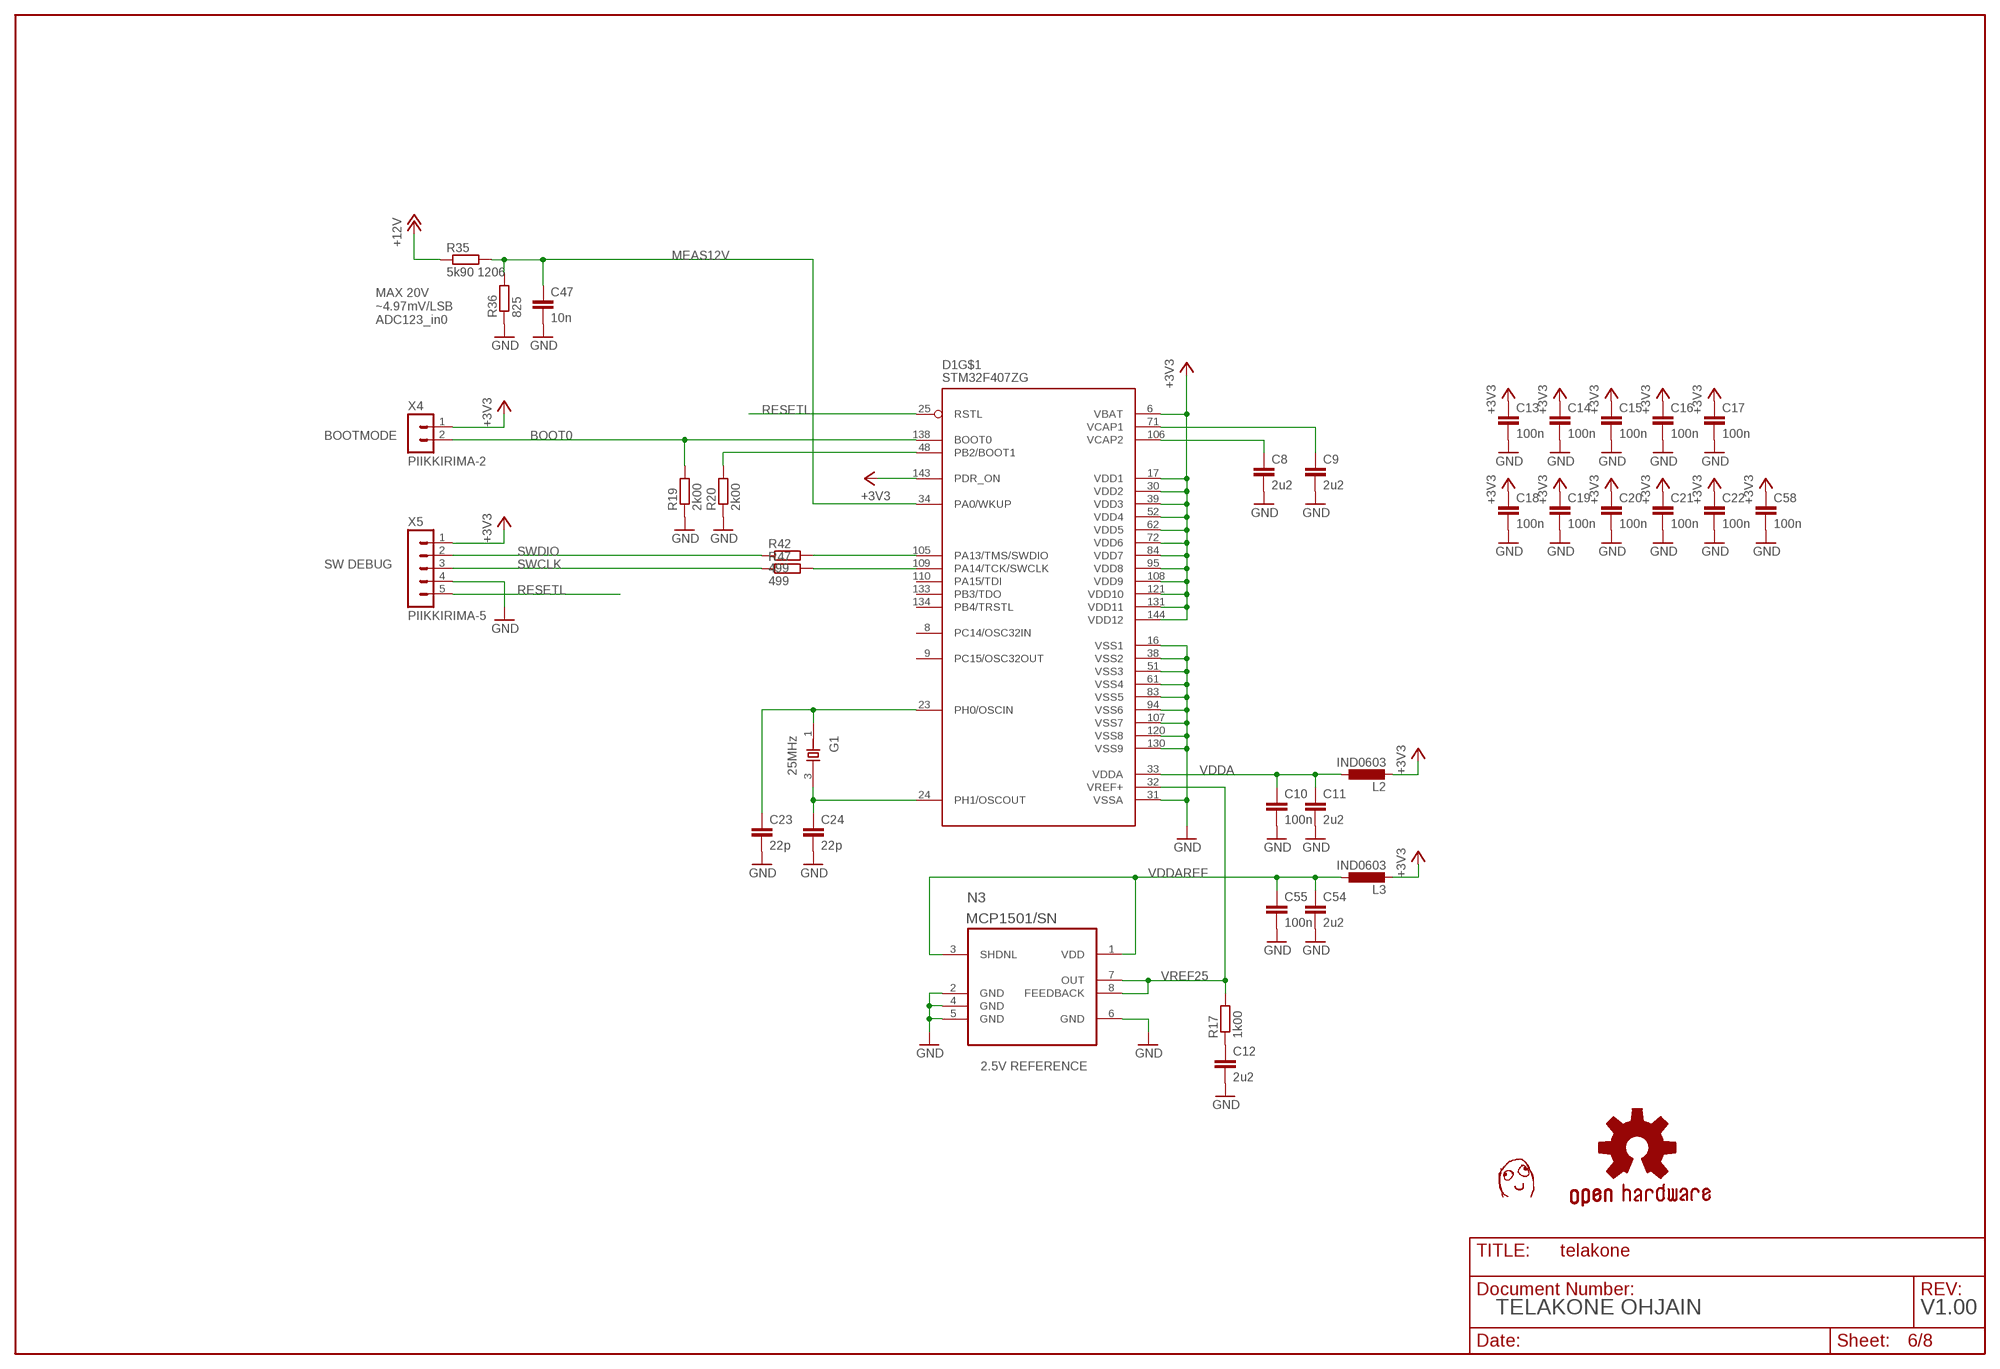
[diagram p5: schematic, sheet 6]

### Parts
C8  2u2  CAP0603  [C0603]
C9  2u2  CAP0603  [C0603]
C10  100n  CAP0603  [C0603]
C11  2u2  CAP0603  [C0603]
C12  2u2  CAP0603  [C0603]
C13  100n  CAP0603  [C0603]
C14  100n  CAP0603  [C0603]
C15  100n  CAP0603  [C0603]
C16  100n  CAP0603  [C0603]
C17  100n  CAP0603  [C0603]
C18  100n  CAP0603  [C0603]
C19  100n  CAP0603  [C0603]
C20  100n  CAP0603  [C0603]
C21  100n  CAP0603  [C0603]
C22  100n  CAP0603  [C0603]
C23  22p  CAP0603  [C0603]
C24  22p  CAP0603  [C0603]
C47  10n  CAP0603  [C0603]
C54  2u2  CAP0603  [C0603]
C55  100n  CAP0603  [C0603]
C58  100n  CAP0603  [C0603]
D1  STM32F407ZG  [LQFP-144]
G1  25MHz  XTAL_3225_SMD  [X_3225]
L2  IND0603  [R0603]
L3  IND0603  [R0603]
N3  MCP1501/SN  [SOIC8-N_MC]
R17  1k00  RES0603  [R0603]
R19  2k00  RES0603  [R0603]
R20  2k00  RES0603  [R0603]
R35  5k90 1206  RES1206  [R1206]
R36  825  RES0603  [R0603]
R42  499  RES0603  [R0603]
R47  499  RES0603  [R0603]
U$11  DAFUG  [DAFUG]
X4  PIIKKIRIMA-2  [PIIKKIRIMA-2]
X5  PIIKKIRIMA-5  [PIIKKIRIMA-5]

### Nets
+3V3: C13.1 C14.1 C15.1 C16.1 C17.1 C18.1 C19.1 C20.1 C21.1 C22.1 C58.1 D1.6(VBAT) D1.17(VDD1) D1.30(VDD2) D1.39(VDD3) D1.52(VDD4) D1.62(VDD5) D1.72(VDD6) D1.84(VDD7) D1.95(VDD8) D1.108(VDD9) D1.121(VDD10) D1.131(VDD11) D1.143(PDR_ON) D1.144(VDD12) L2.2 L3.2 X4.1 X5.1 ; also sheet 1,2,3,4,5,7,8
+12V: R35.1 ; also sheet 1,2,3
BOOT0: D1.138(BOOT0) R19.2 X4.2
GND [other]: C8.2 C9.2 C10.2 C11.2 C12.2 C13.2 C14.2 C15.2 C16.2 C17.2 C18.2 C19.2 C20.2 C21.2 C22.2 C23.2 C24.2 C47.2 C54.2 C55.2 C58.2 D1.16(VSS1) D1.31(VSSA) D1.38(VSS2) D1.51(VSS3) D1.61(VSS4) D1.83(VSS5) D1.94(VSS6) D1.107(VSS7) D1.120(VSS8) D1.130(VSS9) N3.2(GND) N3.4(GND) N3.5(GND) N3.6(GND) R19.1 R20.1 R36.1 X5.4 ; also sheet 1,2,3,4,5,7,8
MEAS12V: C47.1 D1.34(PA0/WKUP) R35.2 R36.2
N$16: D1.109(PA14/TCK/SWCLK) R47.2
N$22: D1.105(PA13/TMS/SWDIO) R42.2
N$24: C12.1 R17.1
N$29: D1.48(PB2/BOOT1) R20.2
OSCIN: C23.1 D1.23(PH0/OSCIN) G1.1(X1)
OSCOUT: C24.1 D1.24(PH1/OSCOUT) G1.3(X2)
RESETL: D1.25(RSTL) X5.5 ; also sheet 1,8
SWCLK: R47.1 X5.3
SWDIO: R42.1 X5.2
VCAP1: C9.1 D1.71(VCAP1)
VCAP2: C8.1 D1.106(VCAP2)
VDDA: C10.1 C11.1 D1.33(VDDA) L2.1
VDDAREF: C54.1 C55.1 L3.1 N3.1(VDD) N3.3(SHDNL)
VREF25: D1.32(VREF+) N3.7(OUT) N3.8(FEEDBACK) R17.2 ; also sheet 3
Unconnected: D1.8(PC14/OSC32IN) D1.9(PC15/OSC32OUT) D1.110(PA15/TDI) D1.133(PB3/TDO) D1.134(PB4/TRSTL)

### Notes on the sheet
- MAX 20V
  ~4.97mV/LSB
  ADC123_in0
- BOOTMODE
- SW DEBUG
- 2.5V REFERENCE
- TELAKONE OHJAIN | V1.00

## Sheet 7 of 8: CPU2
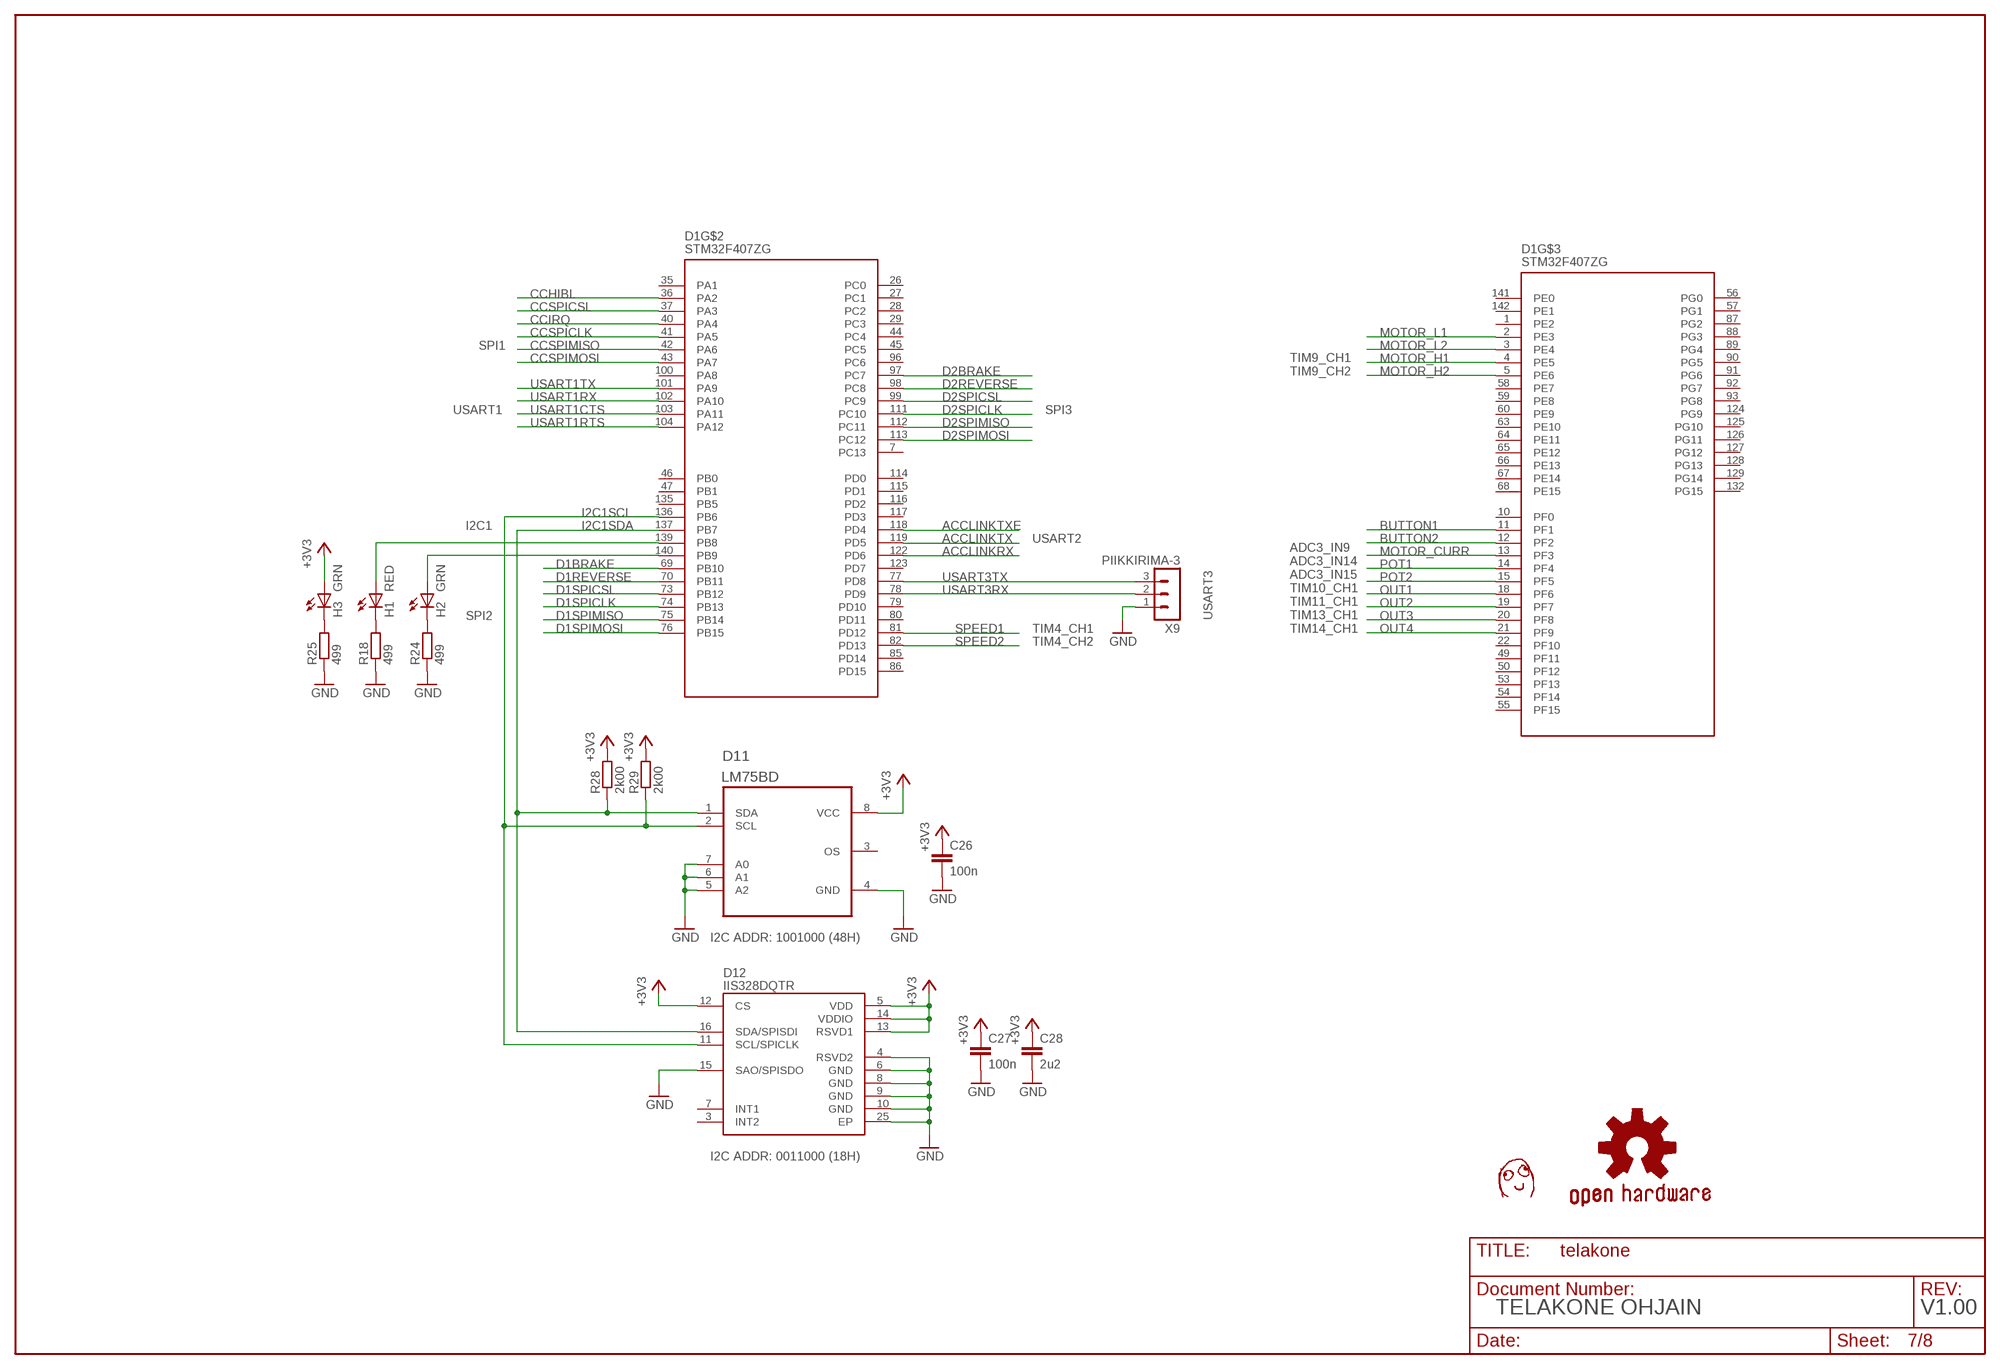
[diagram p6: schematic, sheet 7]

### Parts
C26  100n  CAP0603  [C0603]
C27  100n  CAP0603  [C0603]
C28  2u2  CAP0603  [C0603]
D11  LM75BD  [SOIC8-N_MC]
D12  IIS328DQTR  [QFN50P400X400X100-25N]
H1  RED  LEDCHIP-LED0603  [CHIP-LED0603]
H2  GRN  LEDCHIP-LED0603  [CHIP-LED0603]
H3  GRN  LEDCHIP-LED0603  [CHIP-LED0603]
R18  499  RES0603  [R0603]
R24  499  RES0603  [R0603]
R25  499  RES0603  [R0603]
R28  2k00  RES0603  [R0603]
R29  2k00  RES0603  [R0603]
U$13  DAFUG  [DAFUG]
X9  PIIKKIRIMA-3  [PIIKKIRIMA-3]

### Nets
+3V3: C26.1 C27.1 C28.1 D11.8(VCC) D12.5(VDD) D12.12(CS) D12.13(RSVD1) D12.14(VDDIO) H3.A R28.2 R29.2 ; also sheet 1,2,3,4,5,6,8
ACCLINKRX: D1.122(PD6) ; also sheet 3
ACCLINKTX: D1.119(PD5) ; also sheet 3
ACCLINKTXE: D1.118(PD4) ; also sheet 3
BUTTON1: D1.11(PF1) ; also sheet 3
BUTTON2: D1.12(PF2) ; also sheet 3
CCHIBL: D1.36(PA2) ; also sheet 8
CCIRQ: D1.40(PA4) ; also sheet 8
CCSPICLK: D1.41(PA5) ; also sheet 8
CCSPICSL: D1.37(PA3) ; also sheet 8
CCSPIMISO: D1.42(PA6) ; also sheet 8
CCSPIMOSI: D1.43(PA7) ; also sheet 8
D1BRAKE: D1.69(PB10) ; also sheet 4
D1REVERSE: D1.70(PB11) ; also sheet 4
D1SPICLK: D1.74(PB13) ; also sheet 4
D1SPICSL: D1.73(PB12) ; also sheet 4
D1SPIMISO: D1.75(PB14) ; also sheet 4
D1SPIMOSI: D1.76(PB15) ; also sheet 4
D2BRAKE: D1.97(PC7) ; also sheet 5
D2REVERSE: D1.98(PC8) ; also sheet 5
D2SPICLK: D1.111(PC10) ; also sheet 5
D2SPICSL: D1.99(PC9) ; also sheet 5
D2SPIMISO: D1.112(PC11) ; also sheet 5
D2SPIMOSI: D1.113(PC12) ; also sheet 5
GND [other]: C26.2 C27.2 C28.2 D11.4(GND) D11.5(A2) D11.6(A1) D11.7(A0) D12.4(RSVD2) D12.6(GND) D12.8(GND) D12.9(GND) D12.10(GND) D12.15(SAO/SPISDO) D12.25(EP) R18.1 R24.1 R25.1 X9.1 ; also sheet 1,2,3,4,5,6,8
I2C1SCL: D1.136(PB6) D11.2(SCL) D12.11(SCL/SPICLK) R29.1
I2C1SDA: D1.137(PB7) D11.1(SDA) D12.16(SDA/SPISDI) R28.1
MOTOR_CURR: D1.13(PF3) ; also sheet 2
MOTOR_H1: D1.4(PE5) ; also sheet 2
MOTOR_H2: D1.5(PE6) ; also sheet 2
MOTOR_L1: D1.2(PE3) ; also sheet 2
MOTOR_L2: D1.3(PE4) ; also sheet 2
N$23: H2.C R24.2
N$25: H1.C R18.2
N$26: D1.139(PB8) H1.A
N$27: D1.140(PB9) H2.A
N$28: H3.C R25.2
OUT1: D1.18(PF6) ; also sheet 2
OUT2: D1.19(PF7) ; also sheet 2
OUT3: D1.20(PF8) ; also sheet 2
OUT4: D1.21(PF9) ; also sheet 2
POT1: D1.14(PF4) ; also sheet 3
POT2: D1.15(PF5) ; also sheet 3
SPEED1: D1.81(PD12) ; also sheet 3
SPEED2: D1.82(PD13) ; also sheet 3
USART1CTS: D1.103(PA11) ; also sheet 8
USART1RTS: D1.104(PA12) ; also sheet 8
USART1RX: D1.102(PA10) ; also sheet 8
USART1TX: D1.101(PA9) ; also sheet 8
USART3RX: D1.78(PD9) X9.2
USART3TX: D1.77(PD8) X9.3
Unconnected: D1.1(PE2) D1.7(PC13) D1.10(PF0) D1.22(PF10) D1.26(PC0) D1.27(PC1) D1.28(PC2) D1.29(PC3) D1.35(PA1) D1.44(PC4) D1.45(PC5) D1.46(PB0) D1.47(PB1) D1.49(PF11) D1.50(PF12) D1.53(PF13) D1.54(PF14) D1.55(PF15) D1.56(PG0) D1.57(PG1) D1.58(PE7) D1.59(PE8) D1.60(PE9) D1.63(PE10) D1.64(PE11) D1.65(PE12) D1.66(PE13) D1.67(PE14) D1.68(PE15) D1.79(PD10) D1.80(PD11) D1.85(PD14) D1.86(PD15) D1.87(PG2) D1.88(PG3) D1.89(PG4) D1.90(PG5) D1.91(PG6) D1.92(PG7) D1.93(PG8) D1.96(PC6) D1.100(PA8) D1.114(PD0) D1.115(PD1) D1.116(PD2) D1.117(PD3) D1.123(PD7) D1.124(PG9) D1.125(PG10) D1.126(PG11) D1.127(PG12) D1.128(PG13) D1.129(PG14) D1.132(PG15) D1.135(PB5) D1.141(PE0) D1.142(PE1) D11.3(OS) D12.3(INT2) D12.7(INT1)

### Notes on the sheet
- SPI1
- TIM9_CH1
  TIM9_CH2
- USART1 | SPI3
- I2C1
- USART2
- SPI2 | USART3
- TIM4_CH1
- ADC3_IN9
  ADC3_IN14
  ADC3_IN15
  TIM10_CH1
  TIM11_CH1
  TIM13_CH1
  TIM14_CH1
- TIM4_CH2
- I2C ADDR: 1001000 (48H)
- I2C ADDR: 0011000 (18H)
- TELAKONE OHJAIN | V1.00

## Sheet 8 of 8: WIFI
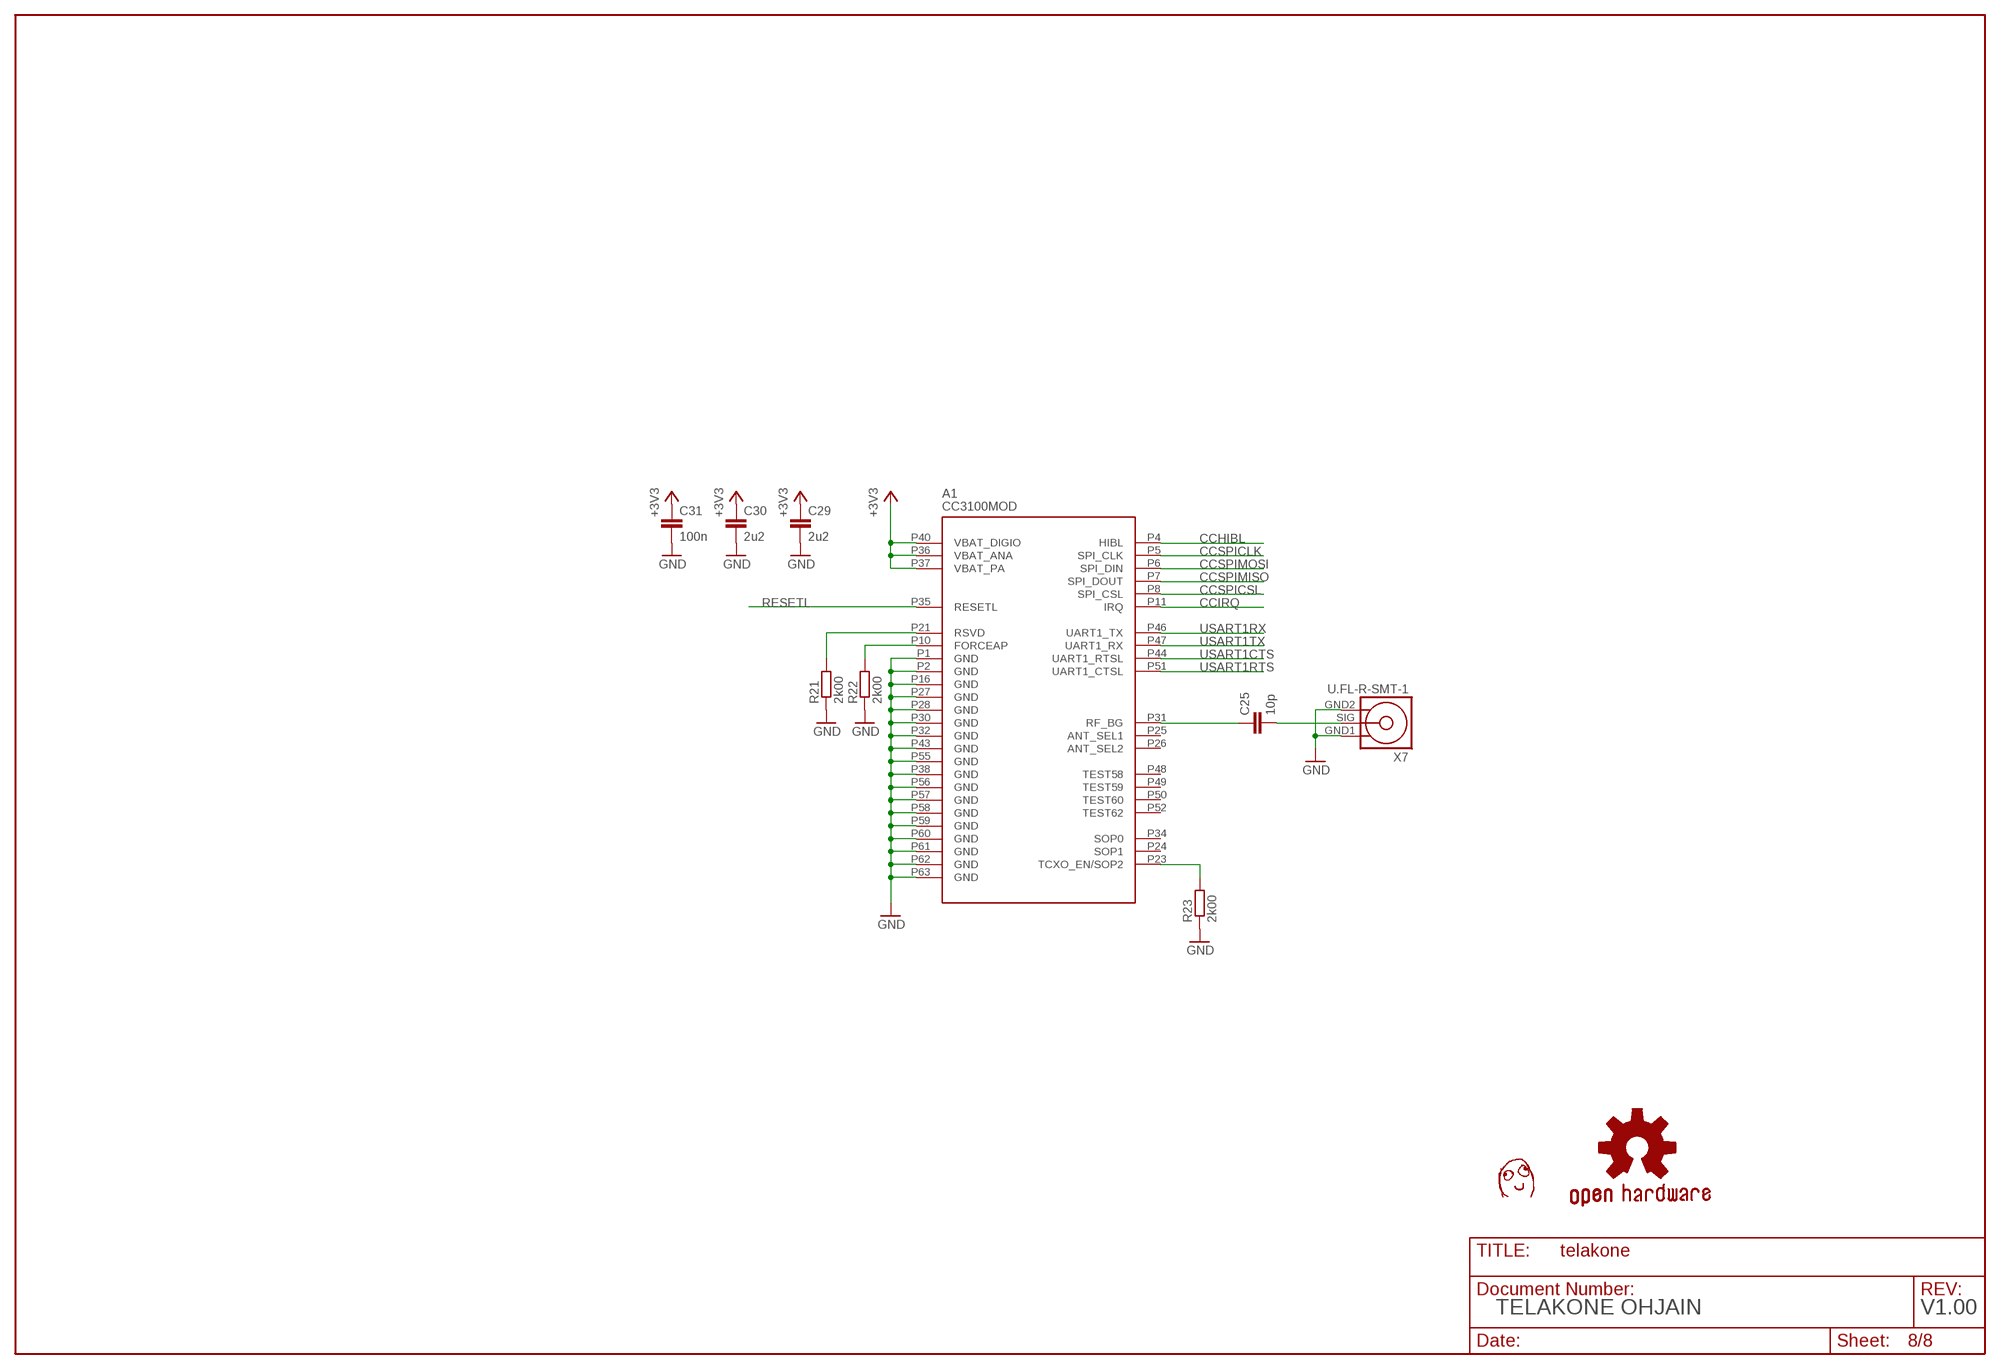
[diagram p7: schematic, sheet 8]

### Parts
A1  CC3100MOD  [CC3100MOD]
C25  10p  CAP0603  [C0603]
C29  2u2  CAP0603  [C0603]
C30  2u2  CAP0603  [C0603]
C31  100n  CAP0603  [C0603]
R21  2k00  RES0603  [R0603]
R22  2k00  RES0603  [R0603]
R23  2k00  RES0603  [R0603]
U$15  DAFUG  [DAFUG]
X7  U.FL-R-SMT-1  [U.FL-R-SMT-1]

### Nets
+3V3: A1.P36(VBAT_ANA) A1.P37(VBAT_PA) A1.P40(VBAT_DIGIO) C29.1 C30.1 C31.1 ; also sheet 1,2,3,4,5,6,7
CCHIBL: A1.P4(HIBL) ; also sheet 7
CCIRQ: A1.P11(IRQ) ; also sheet 7
CCSPICLK: A1.P5(SPI_CLK) ; also sheet 7
CCSPICSL: A1.P8(SPI_CSL) ; also sheet 7
CCSPIMISO: A1.P7(SPI_DOUT) ; also sheet 7
CCSPIMOSI: A1.P6(SPI_DIN) ; also sheet 7
GND [other]: A1.P1(GND) A1.P2(GND) A1.P16(GND) A1.P27(GND) A1.P28(GND) A1.P30(GND) A1.P32(GND) A1.P38(GND) A1.P43(GND) A1.P55(GND) A1.P56(GND) A1.P57(GND) A1.P58(GND) A1.P59(GND) A1.P60(GND) A1.P61(GND) A1.P62(GND) A1.P63(GND) C29.2 C30.2 C31.2 R21.1 R22.1 R23.1 X7.GND1 X7.GND2 ; also sheet 1,2,3,4,5,6,7
N$30: A1.P31(RF_BG) C25.1
N$31: C25.2 X7.SIG
N$32: A1.P21(RSVD) R21.2
N$34: A1.P10(FORCEAP) R22.2
N$35: A1.P23(TCXO_EN/SOP2) R23.2
RESETL: A1.P35(RESETL) ; also sheet 1,6
USART1CTS: A1.P44(UART1_RTSL) ; also sheet 7
USART1RTS: A1.P51(UART1_CTSL) ; also sheet 7
USART1RX: A1.P46(UART1_TX) ; also sheet 7
USART1TX: A1.P47(UART1_RX) ; also sheet 7
Unconnected: A1.P24(SOP1) A1.P25(ANT_SEL1) A1.P26(ANT_SEL2) A1.P34(SOP0) A1.P48(TEST58) A1.P49(TEST59) A1.P50(TEST60) A1.P52(TEST62)

### Notes on the sheet
- TELAKONE OHJAIN | V1.00

## Library data of the parts
A1 = omat_ic_2:CC3100MOD
C1 C37 C45 = EKE:CPOL-EU: POLARIZED CAPACITOR, European symbol
C2-C36 C38-C44 C46-C58 = omat_ic_2:CAP
D1 = omat_ic_2:STM32F407ZG
D2 = omat_ic_2:MAX3088_SA
D5 D15 = omat_ic_2:SI8661-IS1
D10 = omat_ic_2:RT9818C-29GV
D11 = omat_ic_2:LM75BD
D12 = omat_ic_2:IIS328DQTR
F1 = omat_ic_2:KEYSTONE-3549-2
G1 = omat_ic_2:XTAL_3225_SMD: CRYSTAL CLOCK OSCILLATORS 5.0 Vdc or 3.3 Vdc - LOW PROFILE ULTRA MINIATURE CERAMIC SURFACE MOUNT Source: http://www.abracon.com/Oscillators/asf1-L-L1.pdf
H1-H3 = omat_ic_2:LED: LED OSRAM: - CHIPLED LG R971, LG N971, LY N971, LG Q971, LY Q971, LO R971, LY R971 LH N974, LH R974 LS Q976, LO Q976, LY Q976 LO Q996 - Hyper CHIPLED LW Q18S LB Q993, LB Q99A, LB R99A - SideLED LS A670, LO A670, LY A670, LG A670, LP A670 LB A673, LV A673, LT A673, LW A673 LH A674 LY A675 LS A676, LA A676, LO A676, LY A676, LW A676 LS A679, LY A679, LG A679 - Hyper Micro SIDELED® LS Y876, LA Y876, LO Y876, LY Y876 LT Y87S - SmartLED LW L88C, LW L88S LB L89C, LB L89S, LG L890 LS L89K, LO L89K, LY L89K LS L896, LA L896, LO L896, LY L896 - TOPLED LS T670, LO T670, LY T670, LG T670, LP T670 LSG T670, LSP T670, LSY T670, LOP T670, LYG T670 LG T671, LOG T671, LSG T671 LB T673, LV T673, LT T673, LW T673 LH T674 LS T676, LA T676, LO T676, LY T676, LB T676, LH T676, LSB T676, LW T676 LB T67C, LV T67C, LT T67C, LS T67K, LO T67K, LY T67K, LW E67C LS E67B, LA E67B, LO E67B, LY E67B, LB E67C, LV E67C, LT E67C LW T67C LS T679, LY T679, LG T679 LS T770, LO T770, LY T770, LG T770, LP T770 LB T773, LV T773, LT T773, LW T773 LH T774 LS E675, LA E675, LY E675, LS T675 LS T776, LA T776, LO T776, LY T776, LB T776 LHGB T686 LT T68C, LB T68C - Hyper Mini TOPLED® LB M676 - Mini TOPLED Santana® LG M470 LS M47K, LO M47K, LY M47K Source: http://www.osram.convergy.de LUXEON: - LUMILED® LXK2-PW12-R00, LXK2-PW12-S00, LXK2-PW14-U00, LXK2-PW14-V00 LXK2-PM12-R00, LXK2-PM12-S00, LXK2-PM14-U00 LXK2-PE12-Q00, LXK2-PE12-R00, LXK2-PE12-S00, LXK2-PE14-T00, LXK2-PE14-U00 LXK2-PB12-K00, LXK2-PB12-L00, LXK2-PB12-M00, LXK2-PB14-N00, LXK2-PB14-P00, LXK2-PB14-Q00 LXK2-PR12-L00, LXK2-PR12-M00, LXK2-PR14-Q00, LXK2-PR14-R00 LXK2-PD12-Q00, LXK2-PD12-R00, LXK2-PD12-S00 LXK2-PH12-R00, LXK2-PH12-S00 LXK2-PL12-P00, LXK2-PL12-Q00, LXK2-PL12-R00 Source: www.luxeon.com KINGBRIGHT: KA-3528ASYC Source: www.kingbright.com
L1 = omat_ic_2:VLP8040
L2 L3 = omat_ic_2:IND
N1 = omat_ic_2:TPS5430
N2 = omat_ic_2:LTC2050CS5
N3 N7 N11 = omat_ic_2:MCP1501/SN
N4 N8 = omat_ic_2:MCP4921/SN
N5 N9 N13 = omat_ic_2:TS921IDT
N6 N10 = omat_ic_2:MCP3201/SN
N12 = omat_ic_2:AZV3002S
R1-R25 R28-R59 = omat_ic_2:RES
U$1 U$3 U$5 U$7 U$9 U$11 U$13 U$15 = dafug:DAFUG
V1 V6 V22 = omat_ic_2:AO4886
V2 V4 V19 = omat_ic_2:AO4803A
V3 V5 V7 V9 V18 V20 = omat_ic_2:2N7002K
V8 V10-V13 = omat_ic_2:SK34A
V14 V24-V28 = omat_ic_2:ESDAXXSC6
V15-V17 = omat_ic_2:SMAJXXA
V21 = omat_ic_2:SMAJXXCA
V23 = omat_ic_2:SM712
X1 X6 = omat_ic_2:TE_RUUVILIITIN2
X2 X3 X8 X10 X11 = omat_ic_2:MPT0.5/8-2.54
X4 = omat_ic_2:PIIKKIRIMA-2
X5 = omat_ic_2:PIIKKIRIMA-5
X7 = omat_ic_2:U.FL-R-SMT-1
X9 = omat_ic_2:PIIKKIRIMA-3
Y1-Y5 = EKE:PTH

## Net classes
1 isolation: width 0.3 mm, drill 0.5 mm
2 other: width 0.3 mm, drill 0.3 mm, clearance 1 mm to class 1